# EAGLE design B-CAN_Board (EAGLE 9.2.0)
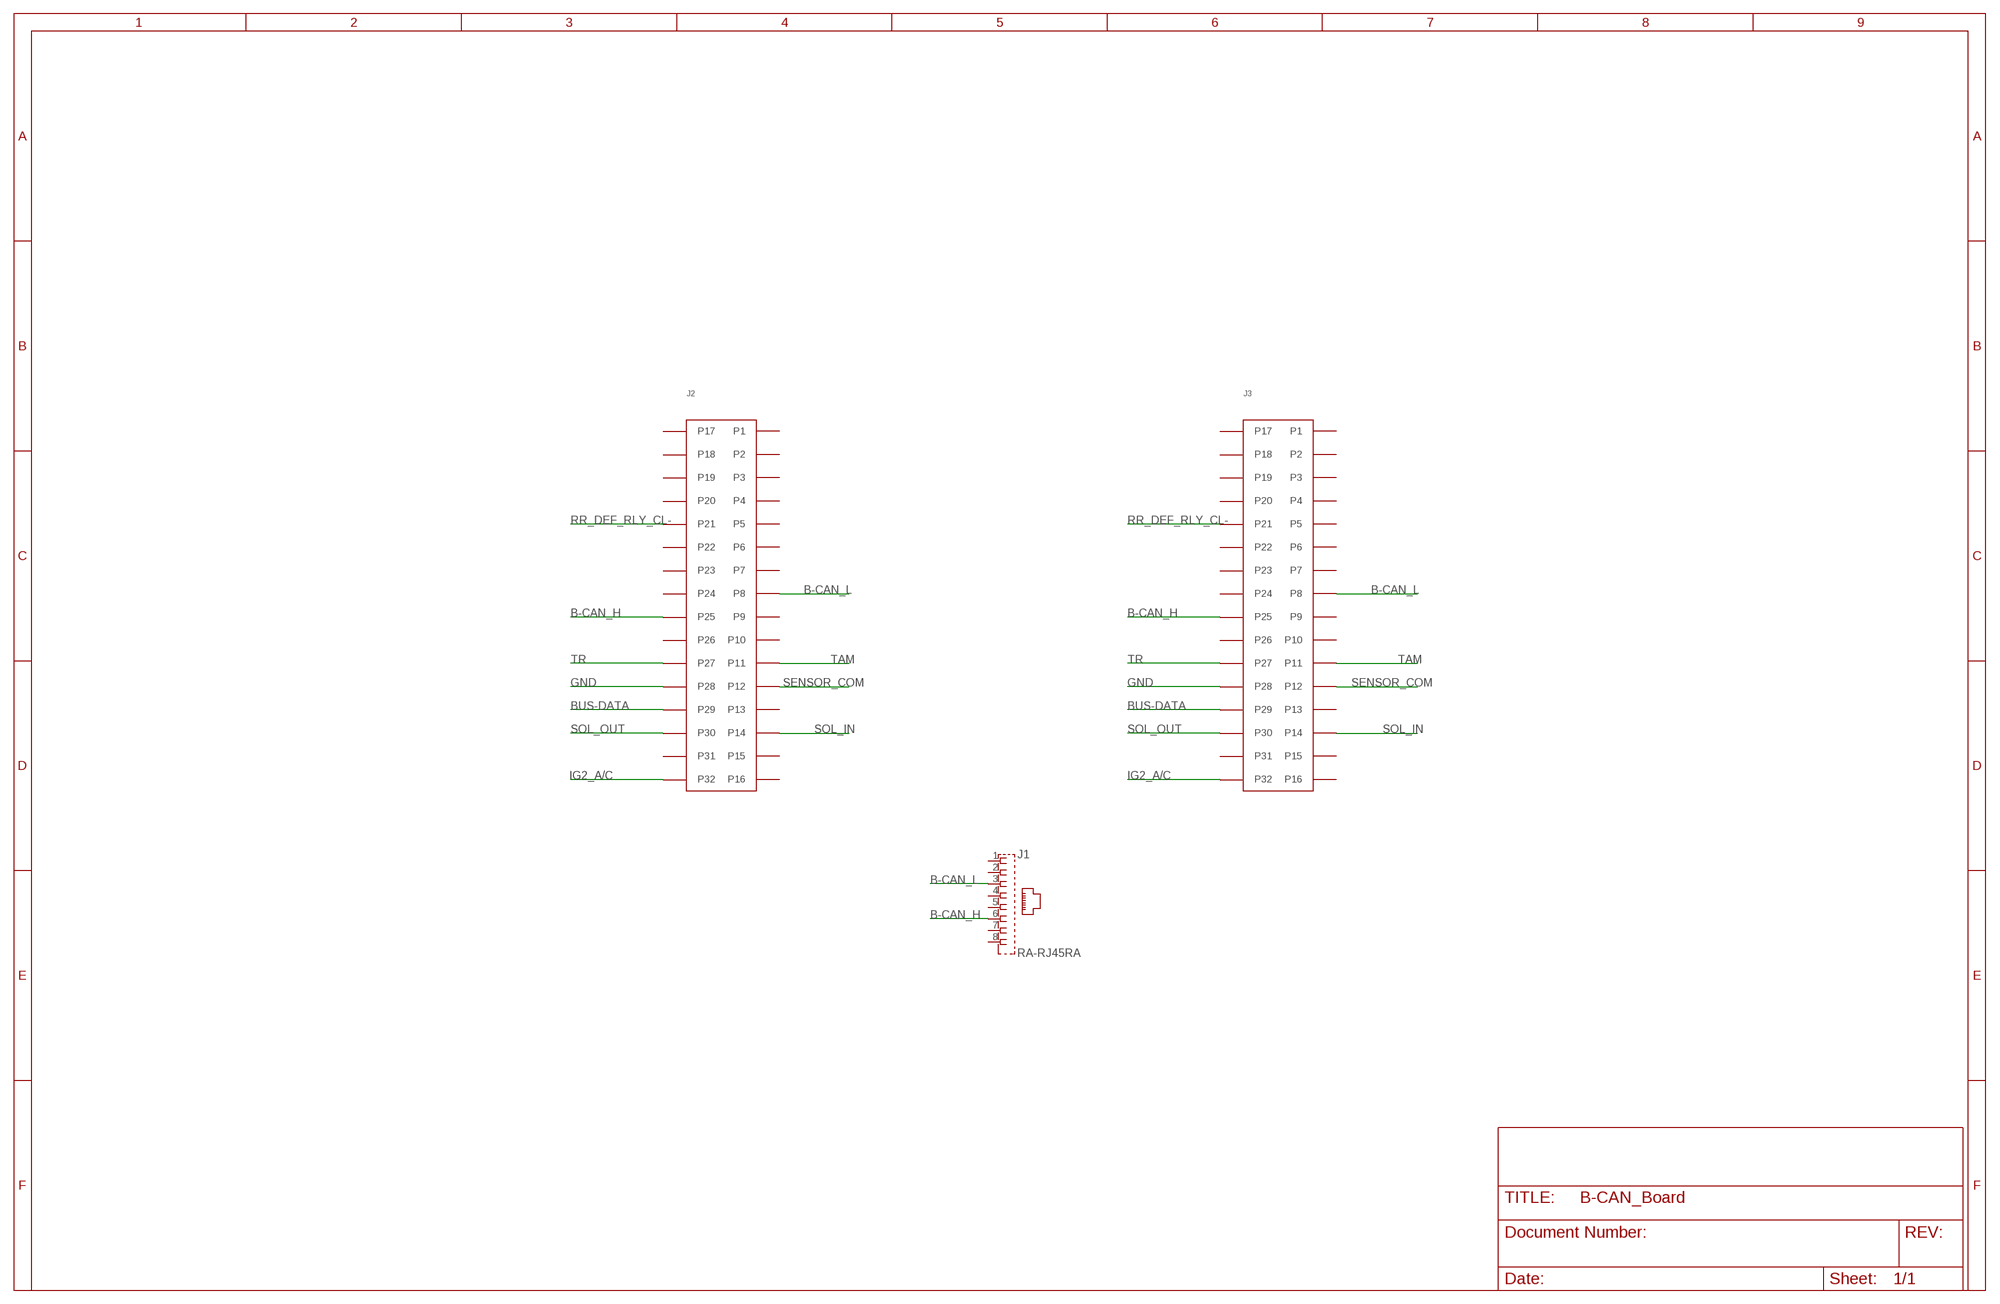
[diagram p0: schematic, sheet 1]

## Parts
J1  RA-RJ45RA  [RA-RJ45]
J2  MX34032UF2  [MX34032UF2]
J3  MX34032UF2  [MX34032UF2]

## Nets
B-CAN_H: J1.6 J2.P25 J3.P25
B-CAN_L: J1.3 J2.P8 J3.P8
BUS-DATA: J2.P29 J3.P29
GND: J2.P28 J3.P28
IG2_A/C: J2.P32 J3.P32
RR_DEF_RLY_CL-: J2.P21 J3.P21
SENSOR_COM: J2.P12 J3.P12
SOL_IN: J2.P14 J3.P14
SOL_OUT: J2.P30 J3.P30
TAM: J2.P11 J3.P11
TR: J2.P27 J3.P27
Unconnected: J1.1 J1.2 J1.4 J1.5 J1.7 J1.8 J2.P1 J2.P2 J2.P3 J2.P4 J2.P5 J2.P6 J2.P7 J2.P9 J2.P10 J2.P13 J2.P15 J2.P16 J2.P17 J2.P18 J2.P19 J2.P20 J2.P22 J2.P23 J2.P24 J2.P26 J2.P31 J3.P1 J3.P2 J3.P3 J3.P4 J3.P5 J3.P6 J3.P7 J3.P9 J3.P10 J3.P13 J3.P15 J3.P16 J3.P17 J3.P18 J3.P19 J3.P20 J3.P22 J3.P23 J3.P24 J3.P26 J3.P31

## Library data of the parts
J1 = comma.ai:RA-RJ45
J2 J3 = MX34032UF2:MX34032UF2

## Board
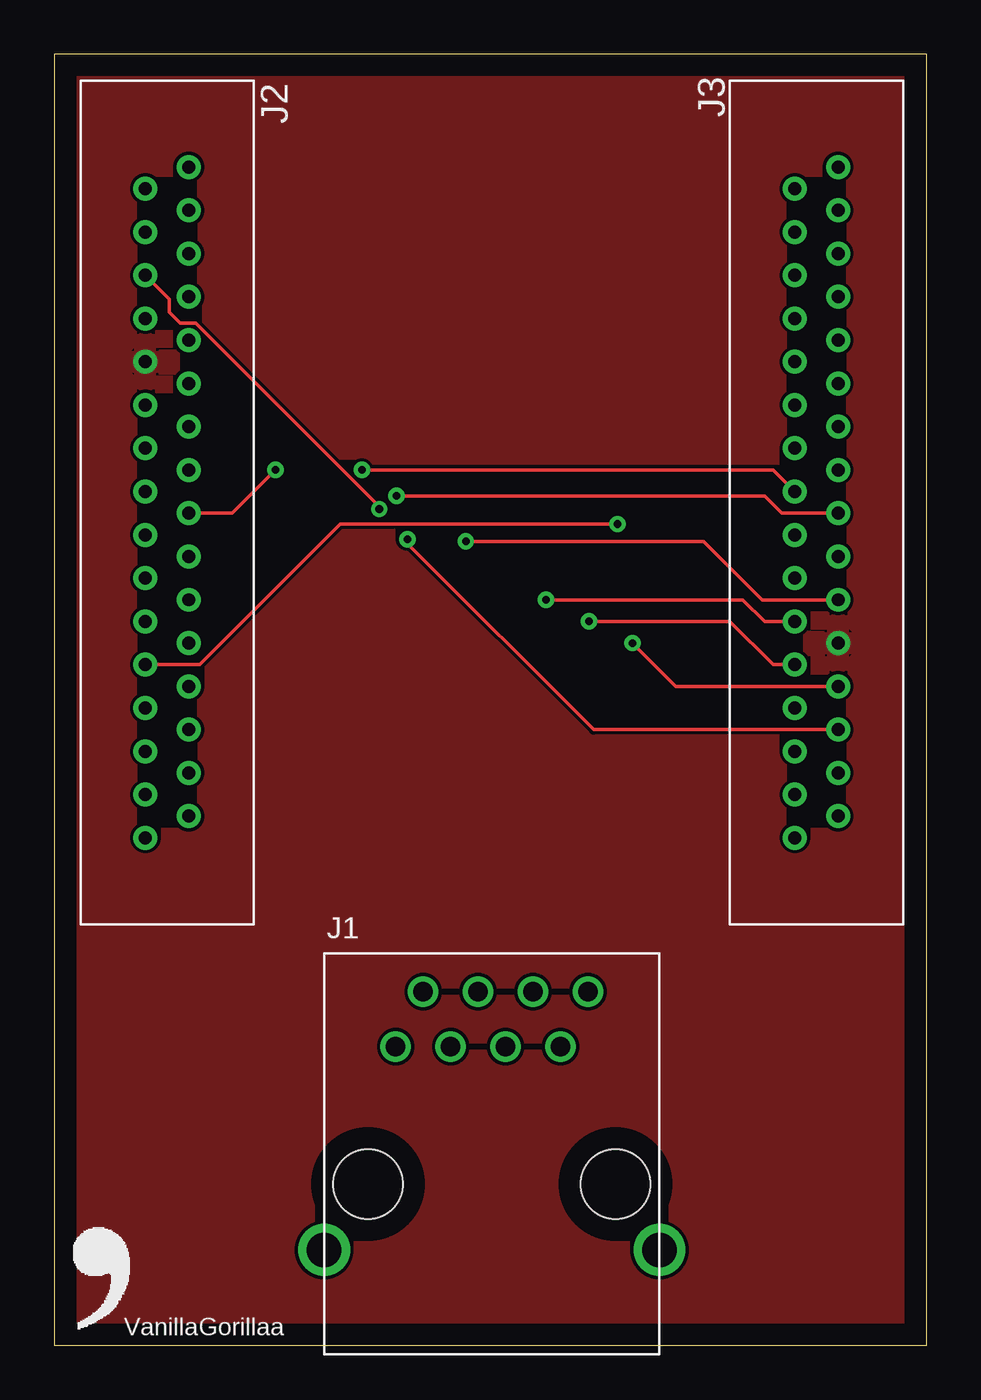
[diagram p1: board, top side]
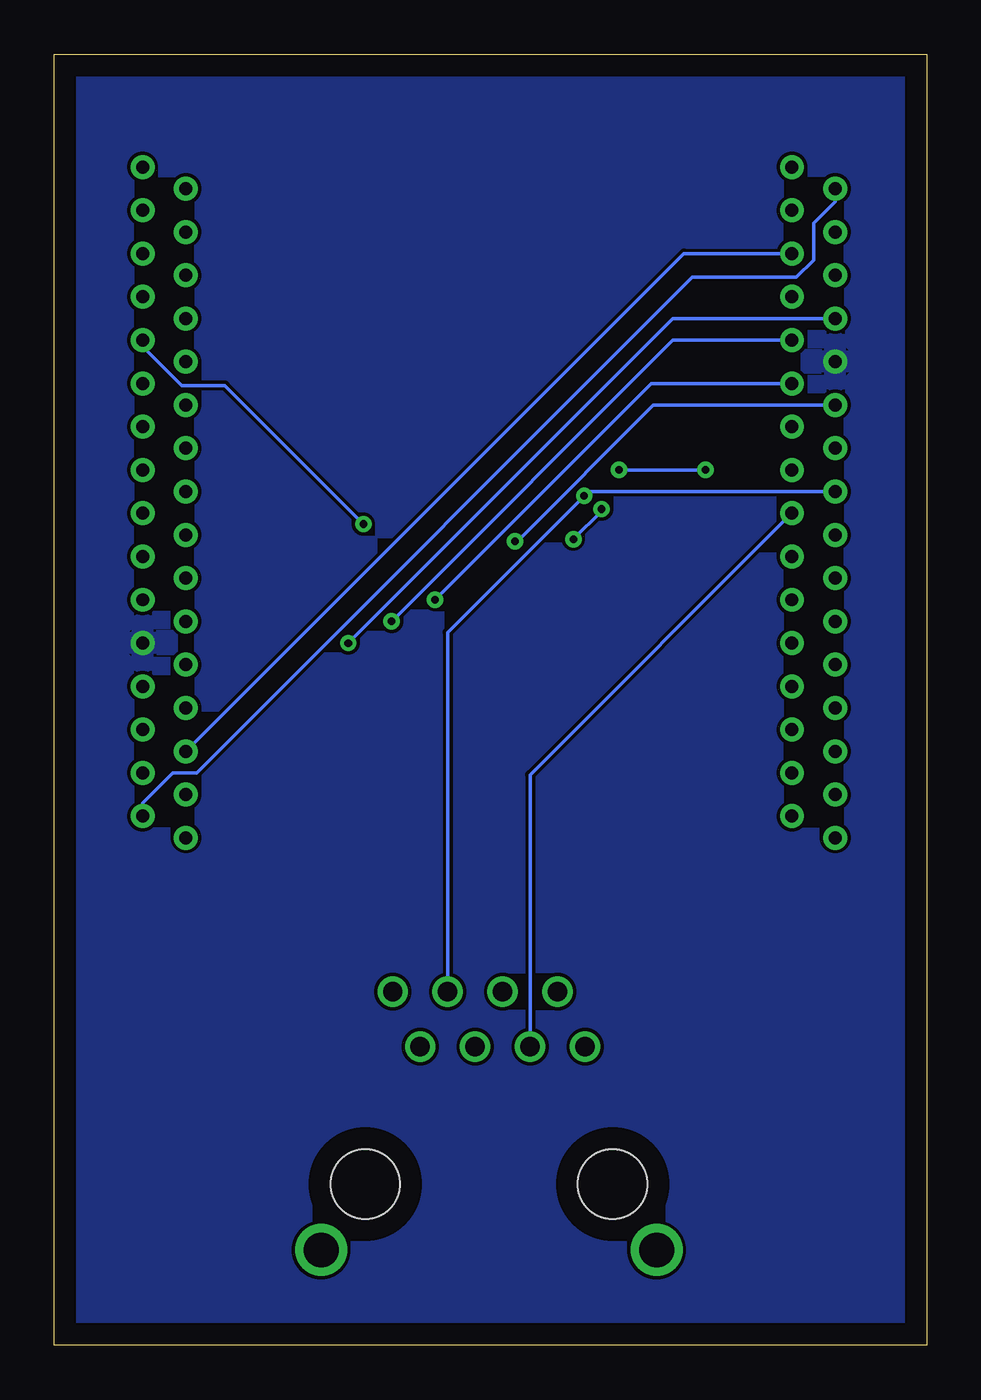
[diagram p2: board, bottom side, seen from below]

Size 40.31 x 59.68 mm. Coordinates in mm from the lower left corner, seen from the top.
Outline: 0,0 40.31,0 40.31,59.68 0,59.68 0,0
Copper layers (1*16): Top 0.035mm / dielectric 1.5mm / Bottom 0.035mm
Design rules "default": minimum track width 6mil, minimum drill 0.35mm, track to track 6mil, track to pad 6mil, pad to pad 6mil, via to via 6mil, smd to smd 6mil, copper to edge 40mil, drill to drill 6mil, minimum pad ring 10mil, minimum via ring 8mil, stop-mask expansion 4mil, vias tented up to drill 0mil, thermal gap 10mil

### Footprints (pad centres in the part's own frame; a part is rotated, then mirrored left to right if it is on the bottom)
RA-RJ45 = drill 0.9: 1 -4.445,6.35; 2 -3.175,8.89; 3 -1.905,6.35; 4 -0.635,8.89; 5 0.635,6.35; 6 1.905,8.89; 7 3.175,6.35; 8 4.445,8.89 | drill 1.6: P$1 -7.75,-3.05; P$2 7.75,-3.05 | hole 3.2: -5.715,0; 5.715,0
MX34032UF2 = drill 0.6: P1 16,1; P2 14,1; P3 12,1; P4 10,1; P5 8,1; P6 6,1; P7 4,1; P8 2,1; P9 0,1; P10 -2,1; P11 -4,1; P12 -6,1; P13 -8,1; P14 -10,1; P15 -12,1; P16 -14,1; P17 17,-1; P18 15,-1; P19 13,-1; P20 11,-1; P21 9,-1; P22 7,-1; P23 5,-1; P24 3,-1; P25 1,-1; P26 -1,-1; P27 -3,-1; P28 -5,-1; P29 -7,-1; P30 -9,-1; P31 -11,-1; P32 -13,-1

### Placement (x,y rotation side)
J1  20.22,7.46 0 top
J2  5.22,40.46 270 top
J3  35.22,37.46 90 top
U$2  [LOGO]  0.22,0.46 0 top

### Tracks (layer width: path | path; a pad name or v marks a point on that pad's centre or on a via)
B-CAN_H  (via drill 0.35)
  Top 0.152: v15.82,39.26 32.82,39.26 33.62,38.46 J3.P25
  Bottom 0.152: J2.P25 15.62,39.46 v15.82,39.26 22.12,32.95 J1.6
B-CAN_L  (via drill 0.35)
  Top 0.152: J3.P8 33.22,40.46 v14.22,40.46 | v10.22,40.46 8.22,38.46 J2.P8
  Bottom 0.152: v14.22,40.46 v10.22,40.46 | J2.P8 18.31,26.37 J1.3
BUS-DATA  (via drill 0.35)
  Top 0.152: v26.72,32.46 28.72,30.46 J3.P29
  Bottom 0.152: J2.P29 11.72,47.46 v26.72,32.46
GND
  pour Top: -0.78,60.46 -0.78,-0.54 41.22,-0.54 41.22,59.46 41.22,60.46
  pour Bottom: -0.78,60.46 -0.78,-0.54 41.22,-0.54 41.22,60.46
IG2_A/C
  Bottom 0.152: J2.P32 4.22,52.86 5.22,51.86 5.22,50.16 6.02,49.36 10.82,49.36 33.72,26.46 34.82,26.46 36.22,25.06 J3.P32
RR_DEF_RLY_CL-  (via drill 0.35)
  Top 0.152: J2.P21 6.72,31.46 13.22,37.96 v26.02,37.96
  Bottom 0.152: v26.02,37.96 32.42,44.36 34.42,44.36 36.22,46.16 J3.P21
SENSOR_COM  (via drill 0.35)
  Top 0.152: v24.72,33.46 31.22,33.46 33.22,31.46 J3.P12
  Bottom 0.152: J2.P12 11.72,46.46 v24.72,33.46
SOL_IN
  Bottom 0.152: J3.P14 11.22,50.46 J2.P14
SOL_OUT  (via drill 0.35)
  Top 0.152: J3.P30 24.92,28.46 16.32,37.06 v16.32,37.26 | J2.P30 5.32,48.36 5.32,47.76 5.84,47.24 6.54,47.24 15.02,38.77 v15.02,38.65
  Bottom 0.152: v16.32,37.26 15.02,38.56 v15.02,38.65
TAM  (via drill 0.35)
  Top 0.152: J3.P11 32.82,33.46 31.82,34.46 v22.72,34.46
  Bottom 0.152: J2.P11 12.72,44.46 v22.72,34.46
TR  (via drill 0.35)
  Top 0.152: v19.02,37.16 30.02,37.16 32.72,34.46 J3.P27
  Bottom 0.152: J2.P27 12.62,43.46 18.92,37.16 v19.02,37.16

### Text on the board
tNames: VanillaGorillaa